# EasyEDA schematic Schematic.json
TITLE: CyberBoard Main PCB; REV: 1.0; Date: 2026-01-15; Sheet: 1/1; Drawn By: Sarthak Tripathi; Company: HackClub
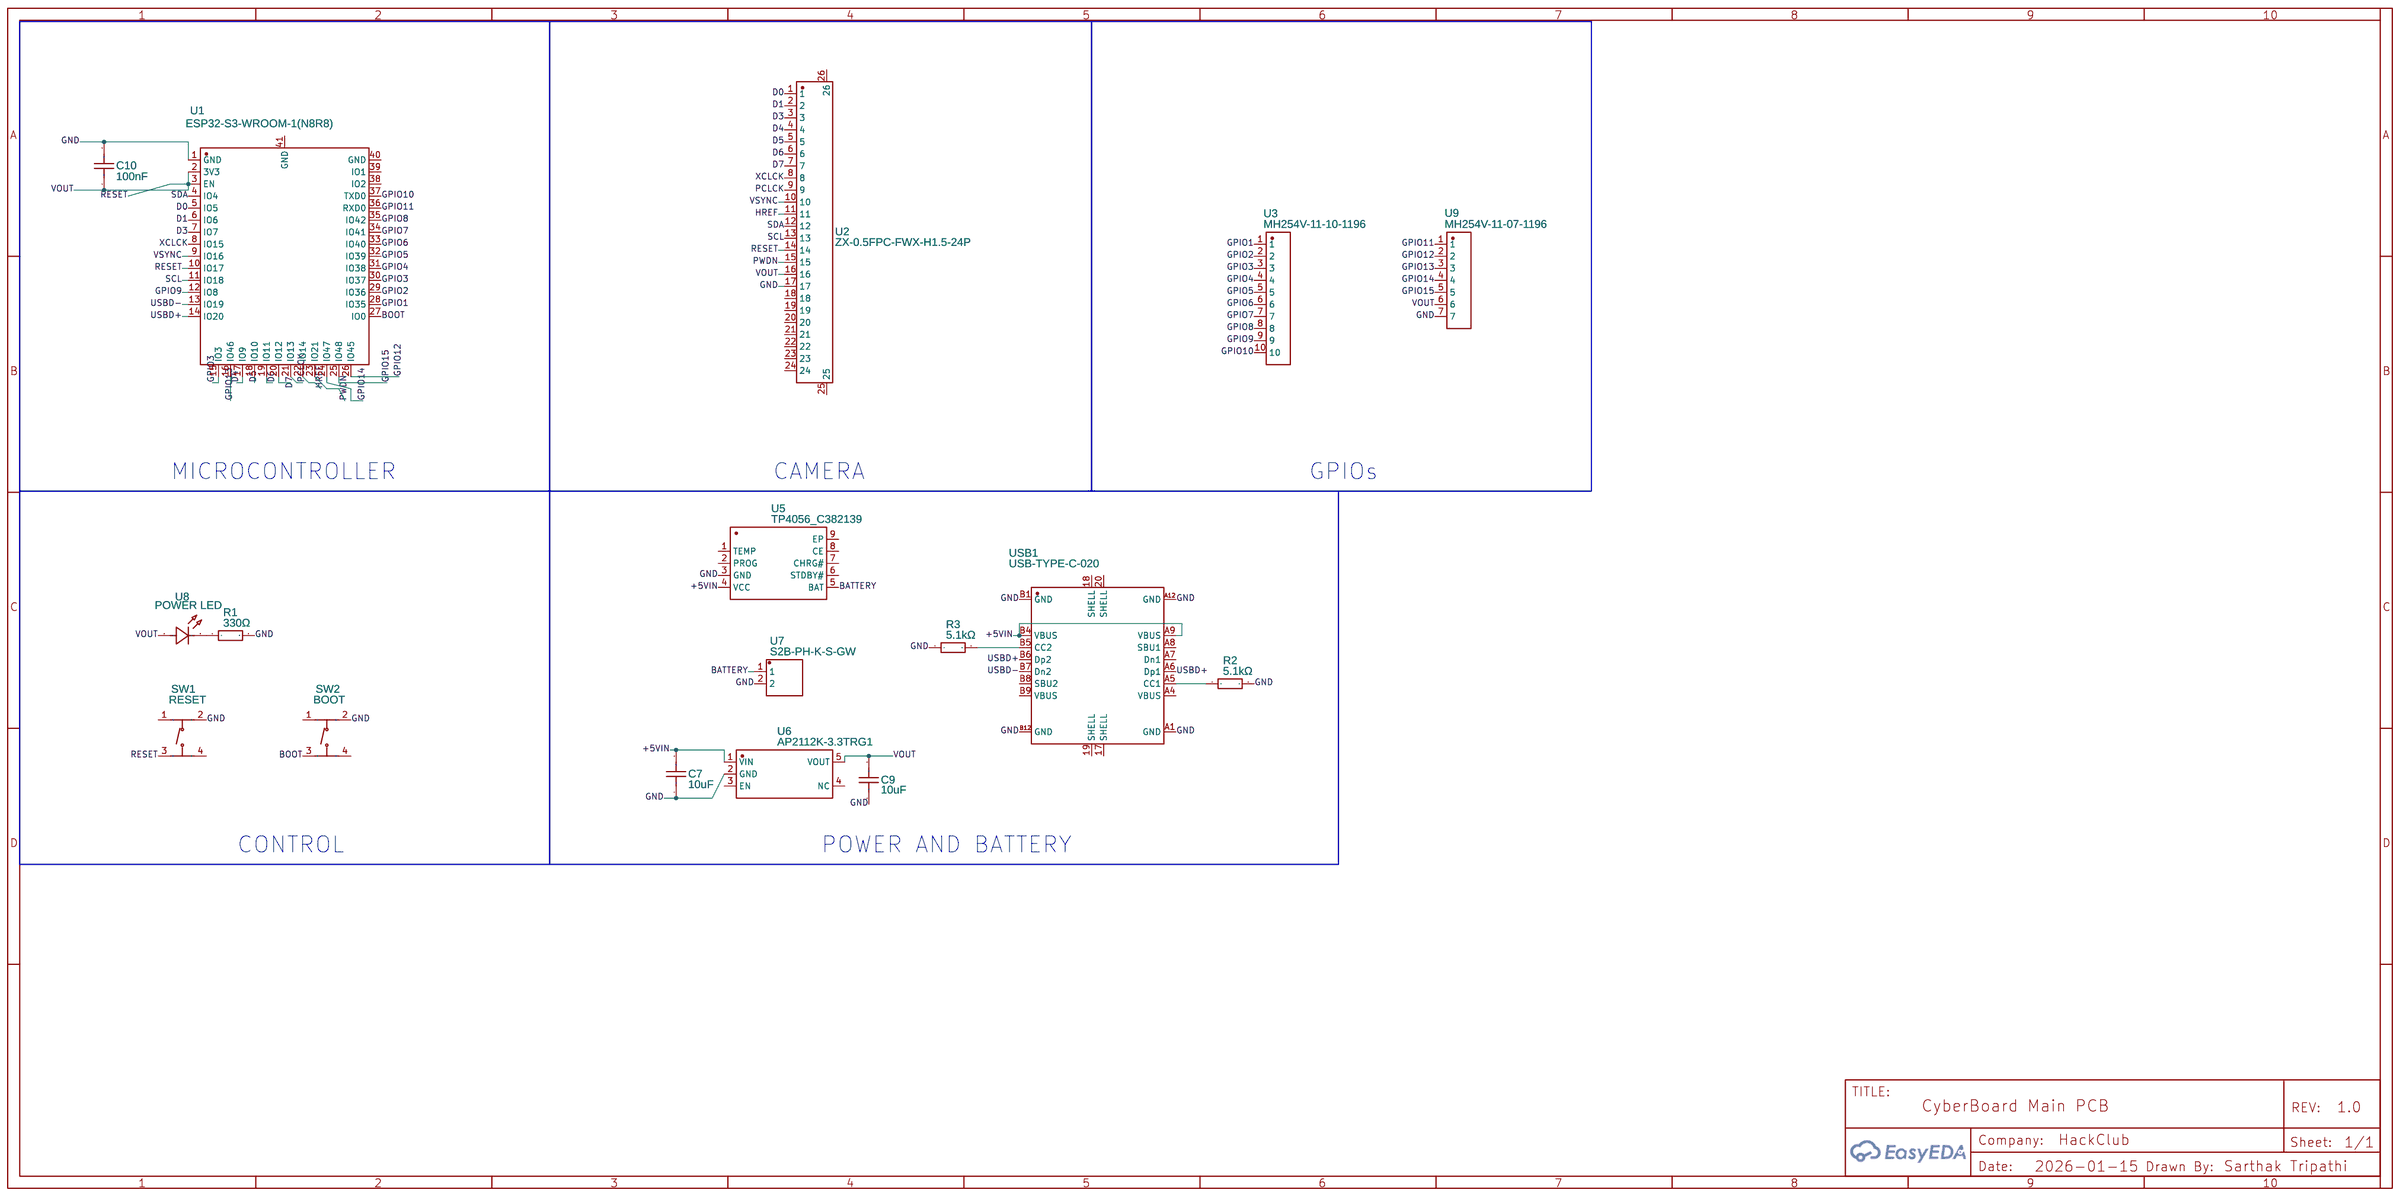
[diagram p0: schematic sheet]

## Parts
C7  10uF  [C0805]
C9  10uF  [C0805]
C10  100nF  [C0603]
R1  330Ω  [R0603]
R2  5.1kΩ  [RES-TH_BD2.3-L6.5-P10.50-D0.5]
R3  5.1kΩ  [RES-TH_BD2.3-L6.5-P10.50-D0.5]
SW1  RESET  [SW-SMD_4P-L5.1-W5.1-P3.70-LS6.5-TL_H1.5]
SW2  BOOT  [SW-SMD_4P-L5.1-W5.1-P3.70-LS6.5-TL_H1.5]
U1  ESP32-S3-WROOM-1(N8R8)  [WIRELM-SMD_ESP32-S3-WROOM-1]
U2  ZX-0.5FPC-FWX-H1.5-24P  [FPC-SMD_24P-P0.50_ZX-0.5FPC-FWX-H1.5-24P]
U3  MH254V-11-10-1196  [HDR-TH_10P-P2.54-V-M]
U5  TP4056_C382139  [ESOP-8_L4.9-W3.9-P1.27-LS6.0-BL-EP]
U6  AP2112K-3.3TRG1  [SOT-25-5_L2.9-W1.6-P0.95-LS2.8-BL]
U7  S2B-PH-K-S-GW  [CONN-TH_S2B-PH-K-S-GW]
U8  POWER LED  [LED0603-FD]
U9  MH254V-11-07-1196  [HDR-TH_7P-P2.54-V-M]
USB1  USB-TYPE-C-020  [USB-SMD_USB-TYPE-C-020]

## Library data of the parts
C7 C9 = GRM21BR61H106KE43L: Contributor: LCSC; Supplier: LCSC; Supplier Part: C440198; Manufacturer: muRata(村田); JLCPCB Part Class: Basic Part
C10 = CC0603KRX7R9BB104: Supplier: LCSC; Manufacturer: YAGEO(国巨); Supplier Part: C14663; JLCPCB Part Class: Basic Part
R1 = 0603WAF3300T5E: Supplier: LCSC; Manufacturer: UNI-ROYAL(厚声); Supplier Part: C23138; JLCPCB Part Class: Basic Part
R2 R3 = MF1/4W-5.1KΩ±1% T52: Contributor: LCSC; Supplier: LCSC; Supplier Part: C119340; Manufacturer: CCO(千志电子); Manufacturer Part: MF1/4W-5.1KΩ±1% T; JLCPCB Part Class: Extended Part
SW1 SW2 = TS-1187A-B-A-B: Contributor: LCSC; Supplier: LCSC; Supplier Part: C318884; Manufacturer: XKB Connection(中国星坤); JLCPCB Part Class: Basic Part
U1 = ESP32-S3-WROOM-1(N8R8): Contributor: LCSC; Supplier: LCSC; Supplier Part: C2913201; Manufacturer: ESPRESSIF(乐鑫); Manufacturer Part: ESP32-S3-WROOM-1-N8R8; JLCPCB Part Class: Extended Part
U2 = ZX-0.5FPC-FWX-H1.5-24P: Supplier: LCSC; Supplier Part: C7544628; Manufacturer: Megastar(兆星); Contributor: lcsc; JLCPCB Part Class: Extended Part
U3 = MH254V-11-10-1196: Contributor: lcsc; Supplier: LCSC; Supplier Part: C5184055; Manufacturer: XFCN(兴飞); JLCPCB Part Class: Extended Part
U5 = TP4056_C382139: Contributor: LCSC; Supplier: LCSC; Supplier Part: C382139; Manufacturer: TPOWER(天源); Manufacturer Part: TP4056; JLCPCB Part Class: Extended Part
U6 = AP2112K-3.3TRG1: Contributor: LCSC; Supplier: LCSC; Manufacturer: DIODES(美台); Supplier Part: C51118; JLCPCB Part Class: Extended Part
U7 = S2B-PH-K-S-GW: Contributor: LCSC; Supplier: LCSC; Supplier Part: C157932; Manufacturer: JST; JLCPCB Part Class: Extended Part
U8 = YLED0603G: Supplier: LCSC; Supplier Part: C19273151; Manufacturer: YONGYUTAI(永裕泰); JLCPCB Part Class: Extended Part; Contributor: lcsc
U9 = MH254V-11-07-1196: Contributor: lcsc; Supplier: LCSC; Supplier Part: C5184053; Manufacturer: XFCN(兴飞); JLCPCB Part Class: Extended Part
USB1 = USB-TYPE-C-020: Supplier: LCSC; Supplier Part: C2927040; Manufacturer: DEALON(德艺隆); Contributor: lcsc; JLCPCB Part Class: Extended Part

## Nets
+5VIN: C7.2 U5.4(VCC) U6.1(VIN) USB1.A9(VBUS) USB1.B4(VBUS)
GND: C7.1 C9.1 C10.2 R1.2 R2.2 R3.1 SW1.2(B) SW2.2(B) U1.1(GND) U2.17 U5.3(GND) U6.2(GND) U7.2 U9.7 USB1.A1(GND) USB1.A12(GND) USB1.B1(GND) USB1.B12(GND)
BATTERY: U5.5(BAT) U7.1
BOOT: SW2.3(C) U1.27(IO0)
D0: U1.5(IO5) U2.1
D1: U1.6(IO6) U2.2
D3: U1.7(IO7) U2.3
D4: U1.17(IO9) U2.4
D5: U1.18(IO10) U2.5
D6: U1.19(IO11) U2.6
D7: U2.7
GPIO1: U1.28(IO35) U3.1
GPIO2: U1.29(IO36) U3.2
GPIO3: U1.15(IO3) U1.30(IO37) U3.3
GPIO4: U1.31(IO38) U3.4
GPIO5: U1.32(IO39) U3.5
GPIO6: U1.33(IO40) U3.6
GPIO7: U1.34(IO41) U3.7
GPIO8: U1.35(IO42) U3.8
GPIO9: U1.12(IO8) U3.9
GPIO10: U1.37(TXD0) U3.10
GPIO11: U1.36(RXD0) U9.1
GPIO12: U1.26(IO45) U9.2
GPIO13: U1.16(IO46) U9.3
GPIO14: U1.24(IO47) U9.4
GPIO15: U1.25(IO48) U9.5
HREF: U1.22(IO14) U2.11
PCLCK: U1.21(IO13) U2.9
PWDN: U1.23(IO21) U2.15
RESET: C9.2 C10.1 SW1.3(C) U1.2(3V3) U1.3(EN) U1.10(IO17) U2.14 U2.16 U6.5(VOUT) U8.1(+) U9.6
SCL: U1.11(IO18) U2.13
SDA: U1.4(IO4) U2.12
USBD+: U1.14(IO20) USB1.A6(Dp1) USB1.B6(Dp2)
USBD-: U1.13(IO19) USB1.B7(Dn2)
VSYNC: U1.9(IO16) U2.10
XCLCK: U1.8(IO15) U2.8
Net-(R1-1): R1.1 U8.2(-)
Net-(R2-1): R2.1 USB1.A5(CC1)
Net-(R3-2): R3.2 USB1.B5(CC2)

Not connected (* = marked no-connect by the designer): SW1 1(A) 4(D); SW2 1(A) 4(D); U1 20(IO12) 38(IO2) 39(IO1) 40(GND) 41(GND); U2 18 19 20 21 22 23 24 25 26; U5 1(TEMP) 2(PROG) 6(STDBY#) 7(CHRG#) 8(CE) 9(EP); U6 3(EN) 4(NC); USB1 17(SHELL) 18(SHELL) 19(SHELL) 20(SHELL) A4(VBUS) A7(Dn1) A8(SBU1) B8(SBU2) B9(VBUS)

## Notes on the sheet
- MICROCONTROLLER
- CAMERA
- GPIOs
- CONTROL
- POWER AND BATTERY
